# Altium project eboardPapyFeederV2.1.PrjPCB
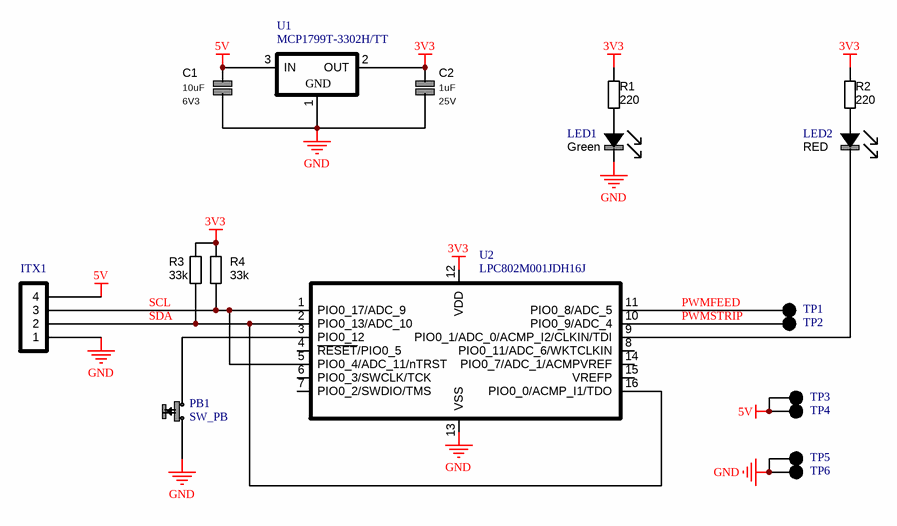
[diagram p0: eboardPapyFeederV2.1.SchDoc]
1 sheet, 18 parts. Net scope: global (net labels, ports and power ports of the same name join across sheets).
Board file: eboardPapyFeederV2.1.PcbDoc

## Sheet eboardPapyFeederV2.1.SchDoc
size A4

### Parts
C1  value 10uF  Voltage: 6V3  [0603_CAP]  (hidden comment: CAP)
C2  value 1uF  Voltage: 25V  [0603_CAP]  (hidden comment: CAP)
ITX1  Header 01X04  [HEADER_1X4_2MM_SPRING_01]  (value not drawn)
LED1  Green  [0603_LED]
LED2  RED  [0603_LED]
PB1  SW_PB  [SKRPABE010]
R1  value 220  [0603_RES]  (hidden comment: RES)
R2  value 220  [0603_RES]  (hidden comment: RES)
R3  value 33k  [0603_RES]  (hidden comment: RES)
R4  value 33k  [0603_RES]  (hidden comment: RES)
TP1  TP  [PAD_TOP_1x5_REC]  (value not drawn)
TP2  TP  [PAD_TOP_1x5_REC]  (value not drawn)
TP3  TP  [PAD_TOP_1x5_REC]  (value not drawn)
TP4  TP  [PAD_TOP_1x5_REC]  (value not drawn)
TP5  TP  [PAD_TOP_1x5_REC]  (value not drawn)
TP6  TP  [PAD_TOP_1x5_REC]  (value not drawn)
U1  Manufacturer Part Number: MCP1799T-3302H/TT  [SOT95P237X112-3N]  (hidden comment: 3P-Fixed_GND_VOUT_VIN)
U2  LPC802M001JDH16J  [SOP65P640X110-16M]

### Nets
3V3: C2.1 R1.2 R2.2 R3.2 R4.2 U1.2(OUT) U2.12(VDD)
5V: C1.1 ITX1.4 TP3.1 TP4.1 U1.3(IN)
GND: C1.2 C2.2 ITX1.1 LED1.2(K) PB1.1 TP5.1 TP6.1 U1.1(GND) U2.13(VSS)
PWMFEED: TP1.1 U2.11(PIO0_8/ADC_5)
PWMSTRIP: TP2.1 U2.10(PIO0_9/ADC_4)
SCL: ITX1.3 R4.1 U2.1(PIO0_17/ADC_9) U2.5(PIO0_4/ADC_11/nTRST)
SDA: ITX1.2 R3.1 U2.2(PIO0_13/ADC_10) U2.16(PIO0_0/ACMP_I1/TDO)
NetLED1_1: LED1.1(A) R1.1
NetLED2_1: LED2.1(A) R2.1
NetLED2_2: LED2.2(K) U2.9(PIO0_1/ADC_0/ACMP_I2/CLKIN/TDI)
NetPB1_2: PB1.2 U2.3(PIO0_12)

Not connected (* = marked no-connect by the designer): U2 4(~{RESET}/PIO0_5) 6(PIO0_3/SWCLK/TCK) 7(PIO0_2/SWDIO/TMS) 8(PIO0_11/ADC_6/WKTCLKIN) 14(PIO0_7/ADC_1/ACMPVREF) 15(VREFP)

### Notes on the sheet
- Title :
- Name :
- Sheet :
- of
- Date :
- Project :
- Rev :
- Author :

### Library data of the parts
C1 = GRM188R60J106ME84J: CAP CER 10UF 6V3 X5R 0603; Manufacturer: Murata Electronics North America; Tolerance: 20,00Â %; Part Name: GRM188R60J106ME84J; Supplier 1: Mouser; Supplier Part Number 1: 81-GRM188R60J106ME4J; Series: GRM; Manufacturer Part Number: GRM188R60J106ME84J; Technologie: CER; Temperature Coefficient: X5R; Operating Temperature: -55Â°C ~ 85Â°C
C2 = CC0603KRX5R8BB105: CAP CER 1uF 25V X5R 0603; Manufacturer: YAGEO; Tolerance: 10.00%; Part Name: CC0603KRX5R8BB105; Supplier 1: Mouser; Supplier Part Number 1: 603-CC603KRX5R8BB105; Series: CC; Manufacturer Part Number: CC0603KRX5R8BB105; Part Status: Active; Technologie: CER; Temperature Coefficient: X5R; Operating Temperature: -55Â°C ~ 85Â°C
ITX1 = 472861001: 4POS spring connector; Manufacturer: MOLEX; Connector Type: NA; Pitch: 2mm; Number of Positions: 4; Current Rating: 1A; Voltage Rated: 200V*; Part Name: 472861001; Supplier 1: Digi-Key; Supplier Part Number 1: WM14329CT-ND; Manufacturer Part Number: 472861001; Series: 47286; Mounting Type: SMD; Number of Rows: 1; Operating Temperature: -20Â° to +70Â°C
LED1 = 599-0081-007F: LED Green 0603; Manufacturer: Dialight; Wavelength: 525nm; Forward  Voltage: 3.1V; Forward  Current: 20mA; Color: Green; Part Name: 599-0081-007F; Supplier 1: Mouser; Supplier Part Number 1: 645-599-0081-007F; Manufacturer Part Number: 599-0081-007F; Operating Temperature: -40°C to 100°C
LED2 = 599-0010-007F: LED RED 0603; Manufacturer: Dialight; Wavelength: 633nm; Forward  Voltage: 2.1V; Forward  Current: 20mA; Color: RED; Part Name: 599-0010-007F; Supplier 1: Mouser; Supplier Part Number 1: 645-599-0010-007F; Manufacturer Part Number: 599-0010-007F; Operating Temperature: -40°C to 100°C
PB1 = SKRPABE010: Mini momentary push button; Manufacturer: ALPS; Connector Type: PB; Current Rating: 50mA; Voltage Rated: 16VDC; Part Name: SKRPABE010; Supplier 1: Mouser; Supplier Part Number 1: 688-SKRPAB; Manufacturer Part Number: SKRPABE010; Mounting Type: SMD; Operating Temperature: -40°C to 90°C
R1 R2 = ERJ-3EKF2200V: RES SMD 220 OHM 1% 1/10W 0603; Manufacturer: Panasonic Electronic Components; Tolerance: ï¿½1%; Power: 0.1W, 1/10W; Temperature Coefficient: ï¿½100ppm/ï¿½C; Part Name: ERJ-3EKF2200V; Datasheets: http://industrial.panasonic.com/www-cgi/jvcr13pz.cgi?E+PZ+3+AOA0002+ERJ3EKF2200V+7+WW; Supplier 1: Digi-Key; Supplier Part Number 1: P220HCT-ND; Series: ERJ; Manufacturer Part Number: ERJ-3EKF2200V; Part Status: Active; Composition: Thick Film; Operating Temperature: -55ï¿½C ~ 155ï¿½C
R3 R4 = ERJ-3EKF3302V: RES SMD 33K OHM 1% 1/10W 0603; Manufacturer: Panasonic Electronic Components; Tolerance: ï¿½1%; Power: 0.1W, 1/10W; Temperature Coefficient: ï¿½100ppm/ï¿½C; Part Name: ERJ-3EKF3302V; Datasheets: http://industrial.panasonic.com/www-cgi/jvcr13pz.cgi?E+PZ+3+AOA0002+ERJ3EKF3302V+7+WW; Supplier 1: Digi-Key; Supplier Part Number 1: P33.0KHCT-ND; Series: ERJ; Manufacturer Part Number: ERJ-3EKF3302V; Part Status: Active; Composition: Thick Film; Operating Temperature: -55ï¿½C ~ 155ï¿½C
TP1-TP6 = PAD_1x5_REC: Manufacturer: None; Part Name: PAD_1x5_REC; Supplier 1: None; Supplier Part Number 1: None; Manufacturer Part Number: None
U1 = MCP1799T-3302H/TT: LDO 3V3 80mA; Manufacturer: MICROCHIP; Polarity: Positive; Output Voltage: 3.3V; Voltage Accuracy: Â±2%; Dropout Voltage: 1.2V; Max Input Voltage: 45V; Part Name: MCP1799T-3302H/TT; Supplier 1: Mouser; Supplier Part Number 1: 579-CP1799T-3302H/TT; Type: LDO; Max Output Current: 80mA; Operating Temperature: -40ï¿½C to 150ï¿½C
U2 = LPC802M001JDH16J: ARM Cortex M0+; Manufacturer: NXP; Voltage: 3.3V; Part Name: LPC802M001JDH16J; Supplier 1: Mouser; Supplier Part Number 1: 771-LPC802M001JDH16J; Manufacturer Part Number: LPC802M001JDH16J; Type: Processor